# EAGLE design EEZ SMPS pre-regulator r1B1 (EAGLE 6.1)
Assembly variants: Farnell, TME

## Sheet 1 of 2
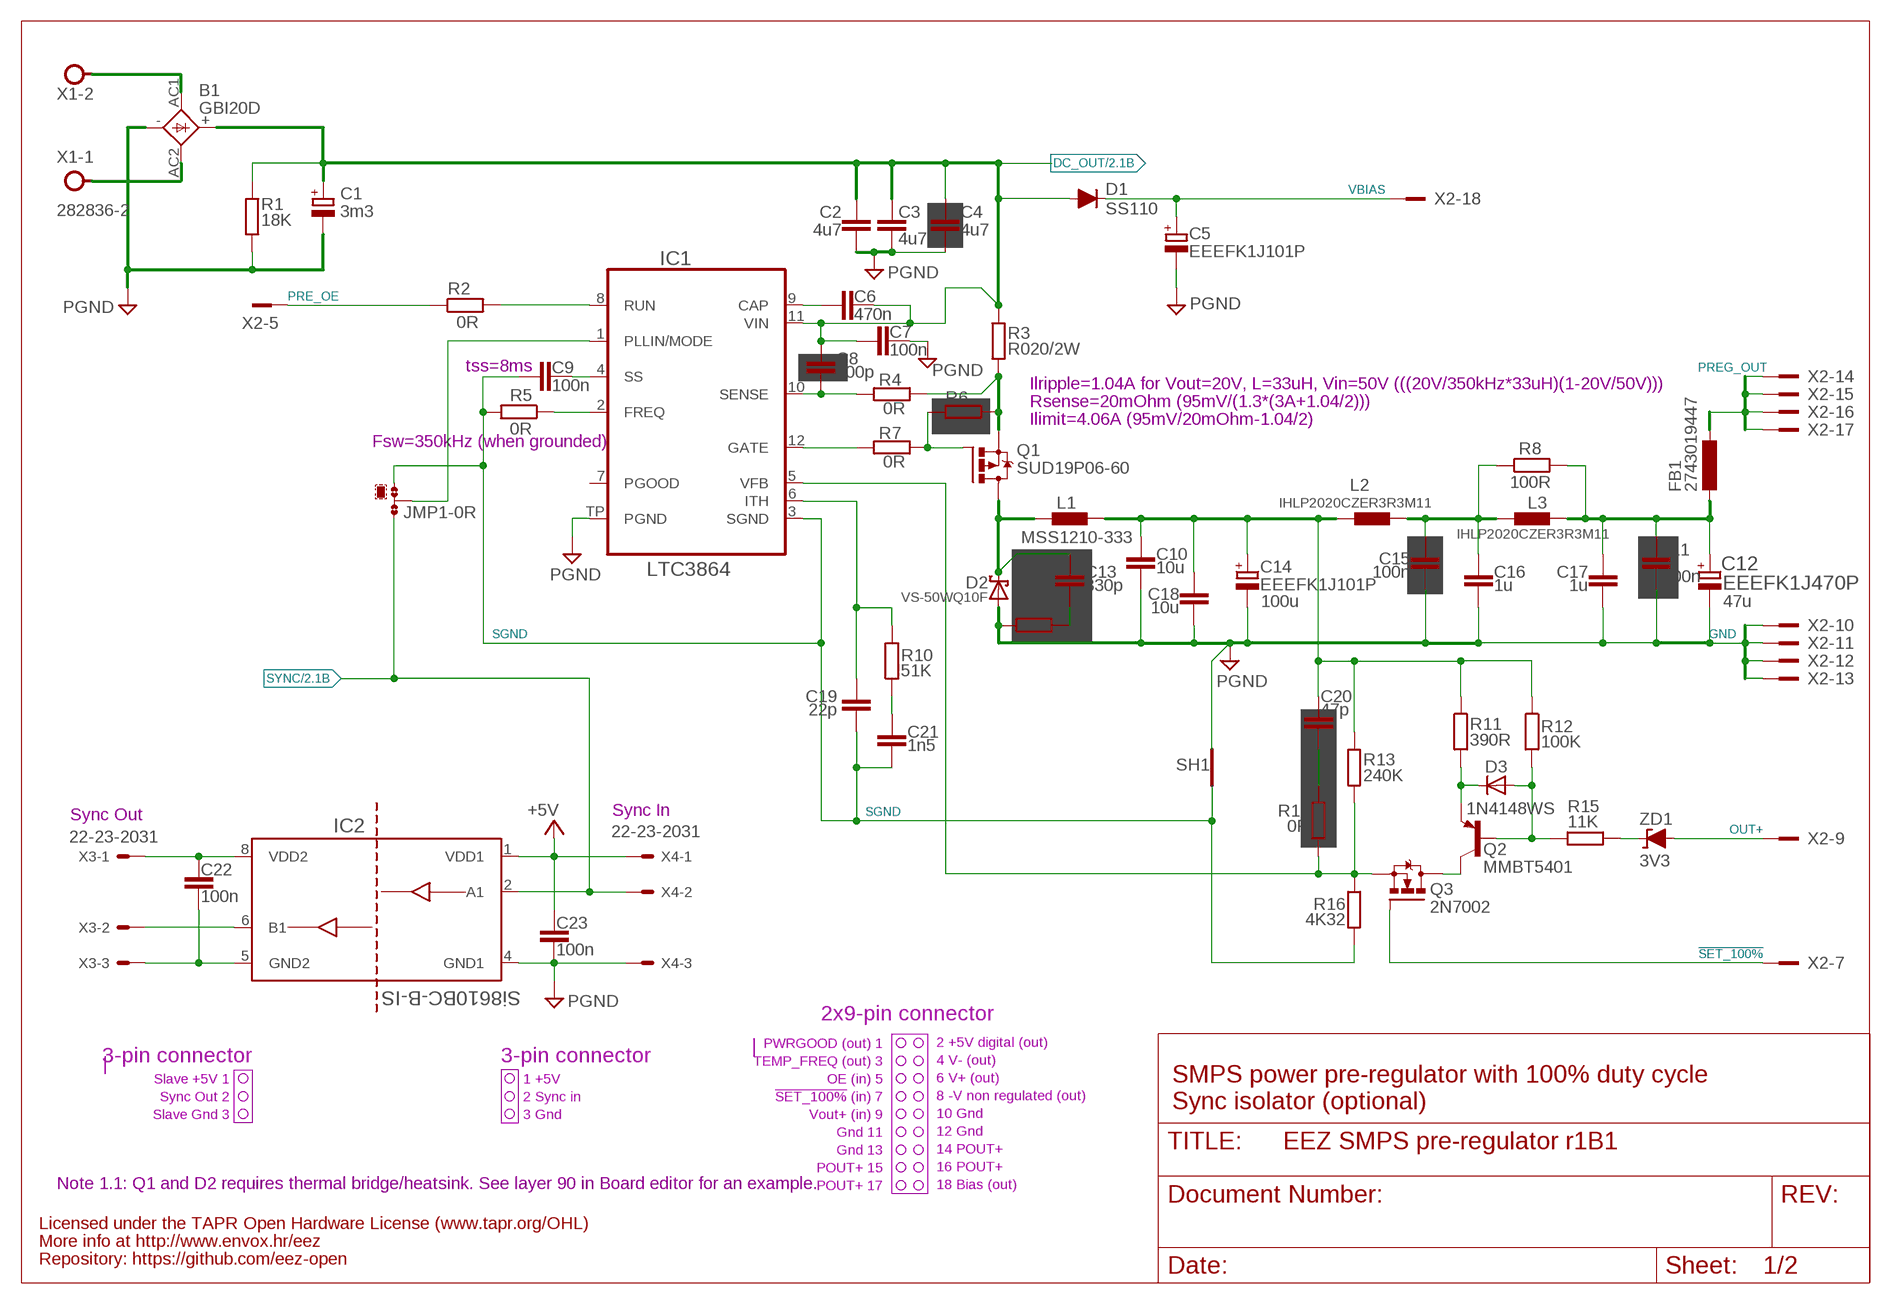
[diagram p0: schematic, sheet 1]

### Parts
B1  GBI20D  BRIDGEDIOTEC  [GBI20]
C1  3m3  ECAP10G_22.5MM  [ECAP10/22.5]
C2  4u7  C-EUC1210  [C1210]
C3  4u7  C-EUC1210  [C1210]
C4  4u7  C-EUC1210  [C1210]
C5  EEEFK1J101P  ECAP5G_10.5MM_F  [ECAP5/10.5+PANASONIC_F]
C6  470n  C-EUC0805  [C0805]
C7  100n  C-EUC0805  [C0805]
C8  100p  C-EUC0805  [C0805]
C9  100n  C-EUC0805  [C0805]
C10  10u  C-EUC1210  [C1210]
C11  100n  C-EUC0805  [C0805]
C12  EEEFK1J470P  EEE-FK1J470P-CASE-F  [CAPAE830X1050N]
C13  330p  C-EUC0805  [C0805]
C14  EEEFK1J101P  ECAP5G_10.5MM_F  [ECAP5/10.5+PANASONIC_F]
C15  100n  C-EUC0805  [C0805]
C16  1u  C-EUC1206  [C1206]
C17  1u  C-EUC1206  [C1206]
C18  10u  C-EUC1210  [C1210]
C19  22p  C-EUC0805  [C0805]
C20  47p  C-EUC0805  [C0805]
C21  1n5  C-EUC0805  [C0805]
C22  100n  C-EUC0603  [C0603]
C23  100n  C-EUC0603  [C0603]
D1  SS110  DIODEDO214AA  [DO214AA]
D2  VS-50WQ10F  SCHOTTKYTO252  [TO252@1]
D3  1N4148WS  DIODE-SOD323-W  [SOD323-W]
FB1  2743019447  L-EUL1812  [L1812]
IC1  LTC3864  [LTC_05-08-1666]
IC2  Si8610BC-B-IS  SI8610  [SOIC127P600X173-8N]
JMP1  0R-JUMPA  [A0R-JMP]
L1  MSS1210-333  COILCRAFT_MSS1210  [MSS1210]
L2  IHLP2020CZER3R3M11  IHLP-2020BZ-11  [IHLP-2020BZ-11]
L3  IHLP2020CZER3R3M11  IHLP-2020BZ-11  [IHLP-2020BZ-11]
Q1  SUD19P06-60  P-MOSFETDPAK  [TO229P990X239-3N]
Q2  MMBT5401  BC857B-PNP-SOT23-BEC  [SOT23-BEC]
Q3  2N7002  [SOT103P240X110-3N]
R1  18K  R-EU_R1206  [R1206]
R2  0R  R-EU_R0805  [R0805]
R3  R020/2W  R-EU_R2512  [R2512]
R4  0R  R-EU_R0805  [R0805]
R5  0R  R-EU_R0805  [R0805]
R6  100K  R-EU_R0805  [R0805]
R7  0R  R-EU_R0805  [R0805]
R8  100R  R-EU_R0805  [R0805]
R9  10R  R-EU_R1206  [R1206]
R10  51K  R-EU_R0805  [R0805]
R11  390R  R-EU_R0805  [R0805]
R12  100K  R-EU_R0805  [R0805]
R13  240K  R-EU_R0805  [R0805]
R14  0R  R-EU_R0805  [R0805]
R15  11K  R-EU_R0805  [R0805]
R16  4K32  R-EU_R0805  [R0805]
SH1  Sgnd to Pgnd short  SHORTNOHOLE  [SHORT_NOHOLE]
X1  282836-2  TBLOCK5.0_2A  [TBLOCK5.0_2]
X2  SSW-109-02-T-D-RA  [SSW-109-02-T-D-RA]
X3  22-23-2031  [22-23-2031]
X4  22-23-2031  [22-23-2031]
ZD1  3V3  ZENER-DIODEMINIMELF  [MINIMELF]

### Nets
!SET_100%: Q3.1(G) X2.7
+5V: C23.1 IC2.1(VDD1) X4.1 ; also sheet 2
DC_OUT: B1.+ C1.+ C2.1 C3.1 C4.1 C6.2 C7.1 C8.1 D1.A IC1.11(VIN) R1.1 R3.1 ; also sheet 2
FB: IC1.5(VFB) Q3.2(S) R13.2 R14.1 R16.1
GND [gnd]: B1.- C1.- C2.2 C3.2 C4.2 C5.- C5.-.1(-) C7.2 C10.2 C11.2 C12.2 C14.- C14.-.1(-) C15.1 C16.2 C17.2 C18.2 C23.2 D2.1(A) D2.2(A) IC1.TP(PGND) IC2.4(GND1) R1.2 R9.1 SH1.P$2(GND_B) X2.10 X2.11 X2.12 X2.13 X4.3 ; supply symbol labelled PGND ; also sheet 2
L_OUT: C10.1 C14.+ C14.+.1(+) C18.1 C20.1 L1.2 L2.1 R11.1 R12.1 R13.1
MODE: IC1.1(PLLIN/MODE) JMP1.2
N$4: D3.A Q2.B R12.2 R15.1
N$7: C20.2 R14.2
N$9: D3.C Q2.E R11.2
N$11: C21.1 R10.1
N$12: Q2.C Q3.3(D)
N$18: B1.AC1 X1.2
N$20: C19.1 IC1.6(ITH) R10.2
N$23: C6.1 IC1.9(CAP)
N$24: C8.2 IC1.10(SENSE) R4.2
N$25: R15.2 ZD1.C
N$28: IC1.12(GATE) R7.2
N$30: Q1.1(G) R6.1 R7.1
N$31: IC1.2(FREQ) R5.1
N$33: C9.2 IC1.4(SS)
N$34: B1.AC2 X1.1
N$35: C15.2 C16.1 L2.2 L3.1 R8.1
N$38: C13.2 R9.2
N$127: IC2.6(B1) X3.2
N$193: C22.1 IC2.8(VDD2) X3.1
N$198: C22.2 IC2.5(GND2) X3.3
OUT+: X2.9 ZD1.A
P_OUT: C11.1 C12.1 C17.1 FB1.1 L3.2 R8.2
PRE_OE: R2.1 X2.5
PREG_OUT: FB1.2 X2.14 X2.15 X2.16 X2.17
SD: IC1.8(RUN) R2.2
SENSE: Q1.3(S) R3.2 R4.1 R6.2
SGND: C9.1 C19.2 C21.2 IC1.3(SGND) JMP1.1 R5.2 R16.2 SH1.P$1(GND_A)
SW [sw]: C13.1 D2.3(C) L1.1 Q1.2(D)
SYNC: IC2.2(A1) JMP1.3 X4.2 ; also sheet 2
VBIAS: C5.+ C5.+.1(+) D1.C X2.18
Unconnected: IC1.7(PGOOD)

### Notes on the sheet
- tss=8ms
- Ilripple=1.04A for Vout=20V, L=33uH, Vin=50V (((20V/350kHz*33uH)(1-20V/50V)))
- Rsense=20mOhm (95mV/(1.3*(3A+1.04/2)))
- Ilimit=4.06A (95mV/20mOhm-1.04/2)
- Fsw=350kHz (when grounded)
- 100u | 47u
- Sync Out | Sync In
- 2x9-pin connector
- PWRGOOD (out) 1
- 3-pin connector | 3-pin connector | 2 +5V digital (out)
- TEMP_FREQ (out) 3
- 4 V- (out)
- Slave +5V 1 | 1 +5V | OE (in) 5
- 6 V+ (out) | SMPS power pre-regulator with 100% duty cycle
- Sync Out 2 | 2 Sync in | !SET_100%! (in) 7
- 8 -V non regulated (out)
- Slave Gnd 3 | 3 Gnd | Vout+ (in) 9 | Sync isolator (optional)
- 10 Gnd
- Gnd 11
- 12 Gnd
- Gnd 13
- 14 POUT+
- POUT+ 15
- 16 POUT+
- POUT+ 17
- Note 1.1: Q1 and D2 requires thermal bridge/heatsink. See layer 90 in Board editor for an example. | 18 Bias (out)
- Licensed under the TAPR Open Hardware License (www.tapr.org/OHL)
- More info at http://www.envox.hr/eez
- Repository: https://github.com/eez-open

## Sheet 2 of 2
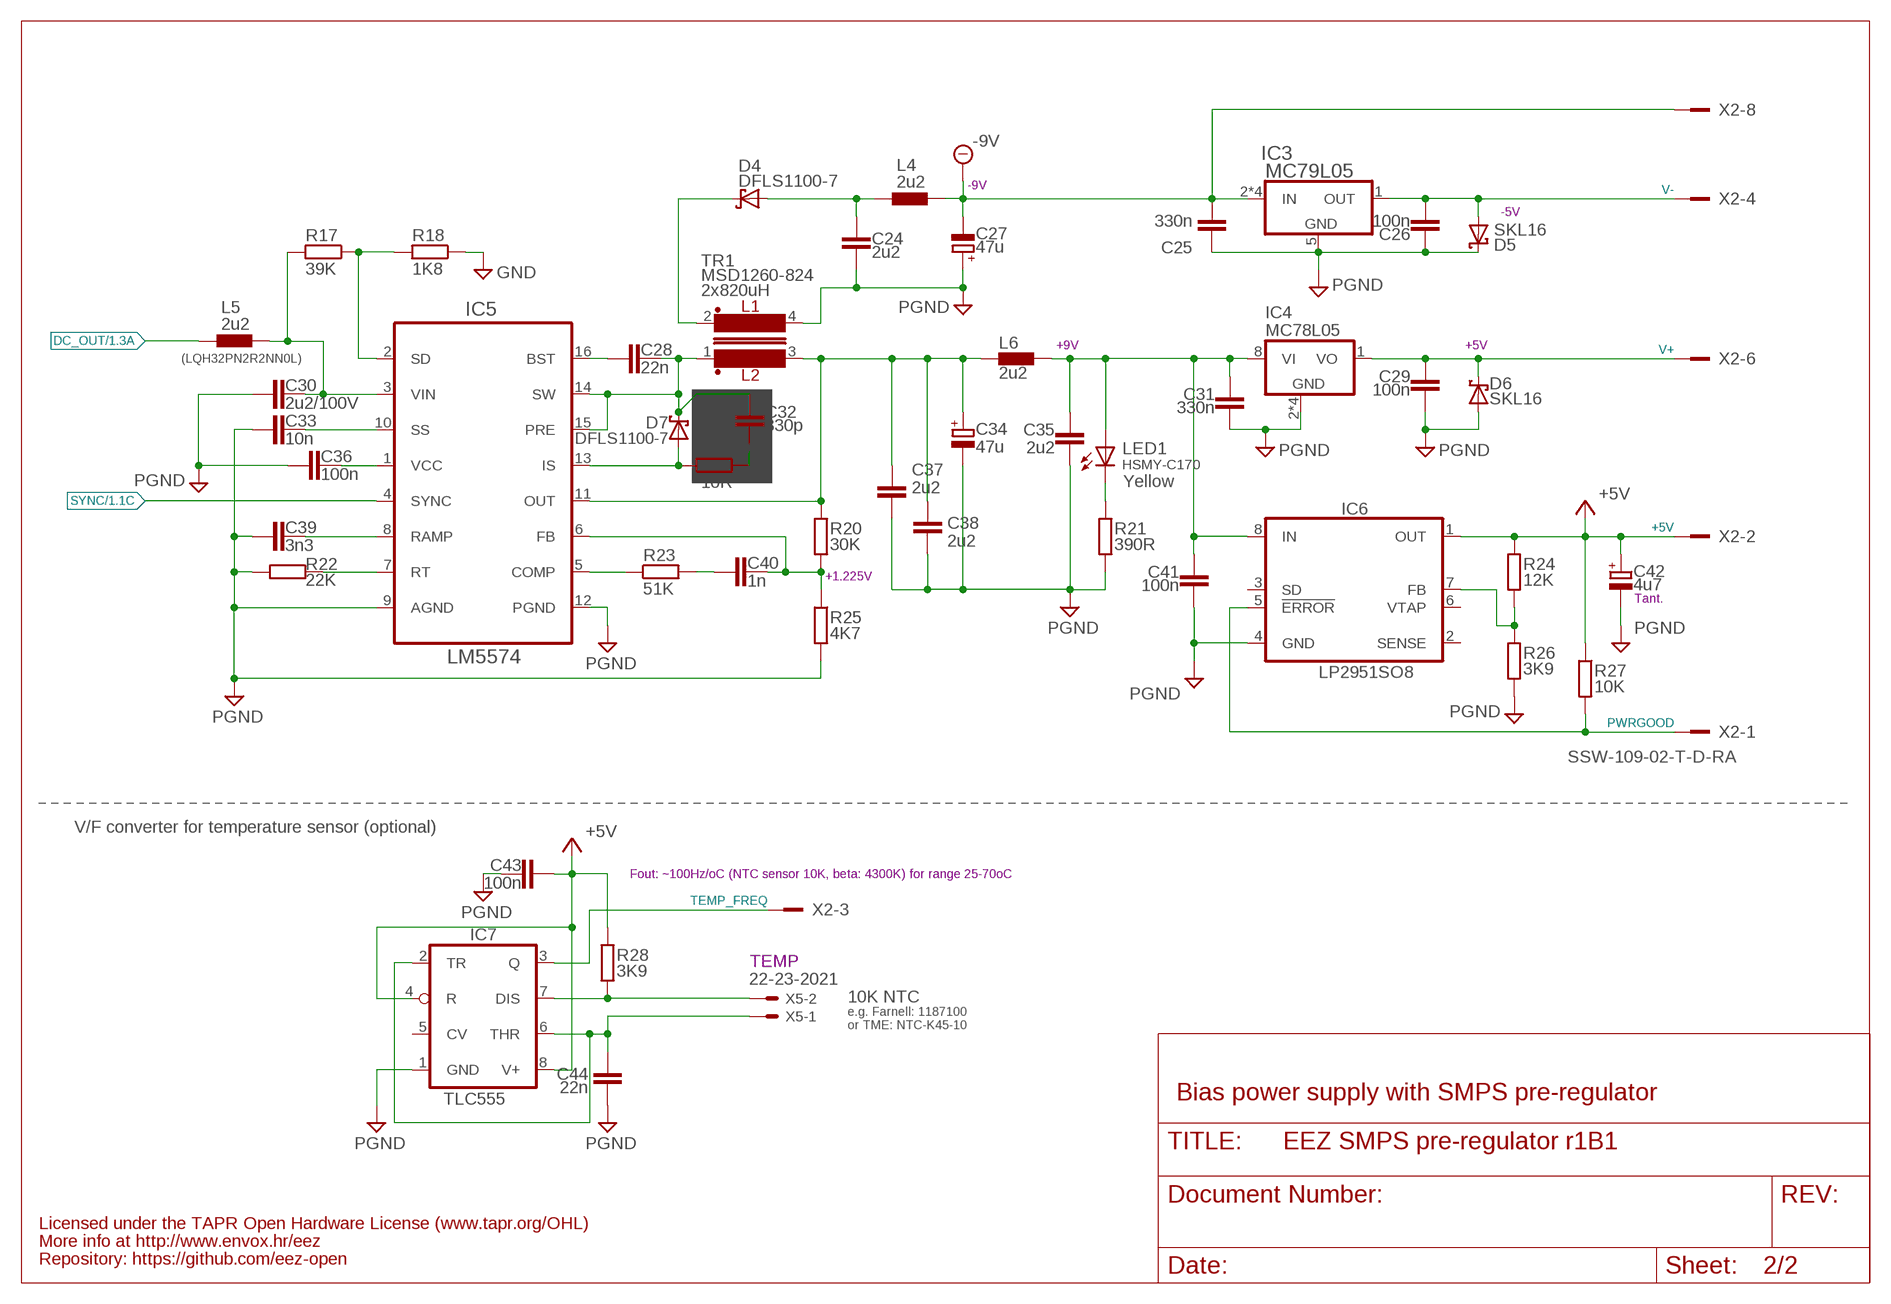
[diagram p1: schematic, sheet 2]

### Parts
C24  2u2  C-EUC0805  [C0805]
C25  330n  C-EUC0805  [C0805]
C26  100n  C-EUC0805  [C0805]
C27  47u  ECAPPANASONIC_H  [CAPAE660X610N]
C28  22n  C-EUC0805  [C0805]
C29  100n  C-EUC0805  [C0805]
C30  2u2/100V  C-EUC1210  [C1210]
C31  330n  C-EUC0805  [C0805]
C32  330p  C-EUC0805  [C0805]
C33  10n  C-EUC0805  [C0805]
C34  47u  ECAPPANASONIC_H  [CAPAE660X610N]
C35  2u2  C-EUC0805  [C0805]  (variant Farnell: 2320829)  (variant TME: CL21B225KAFNNNG )
C36  100n  C-EUC0805  [C0805]
C37  2u2  C-EUC0805  [C0805]  (variant Farnell: 2320829)  (variant TME: CL21B225KAFNNNG )
C38  2u2  C-EUC0805  [C0805]  (variant Farnell: 2320829)  (variant TME: CL21B225KAFNNNG )
C39  3n3  C-EUC0805  [C0805]
C40  1n  C-EUC0805  [C0805]
C41  100n  C-EUC0805  [C0805]
C42  4u7  ECAP1206  [EC1206]
C43  100n  C-EUC0603  [C0603]
C44  22n  C-EUC0805  [C0805]
D4  DFLS1100-7  SCHOTTKYSOD123  [SOD123]
D5  SKL16  SCHOTTKYSOD123  [SOD123]
D6  SKL16  SCHOTTKYSOD123  [SOD123]
D7  DFLS1100-7  SCHOTTKYSOD123  [SOD123]
IC3  MC79L05  MC79LXXSOIC  [SOIC127P600X173-8N]
IC4  MC78L05  MC78LXXSOIC8  [SOIC127P600X173-8N]
IC5  LM5574  [SOP65P640X110-16N]
IC6  LP2951SO8  [SOIC127P600X175-8N]
IC7  TLC555  LM555SOIC8  [SOIC127P600X175-8N]
L4  2u2  L1210  [L1210]
L5  2u2  L1210  [L1210]
L6  2u2  L1210  [L1210]
LED1  HSMY-C170  LEDCHIPLED_0805  [CHIPLED_0805]
R17  39K  R-EU_R0805  [R0805]
R18  1K8  R-EU_R0805  [R0805]
R19  10R  R-EU_R1206  [R1206]
R20  30K  R-EU_R0805  [R0805]
R21  390R  R-EU_R0805  [R0805]
R22  22K  R-EU_R0805  [R0805]
R23  51K  R-EU_R0805  [R0805]
R24  12K  R-EU_R0805  [R0805]
R25  4K7  R-EU_R0805  [R0805]
R26  3K9  R-EU_R0805  [R0805]
R27  10K  R-EU_R0805  [R0805]
R28  3K9  R-EU_R0805  [R0805]
TR1  MSD1260-824  COILCRAFT_MSD1260INV  [MSD1260]
X5  22-23-2021  [22-23-2021]

### Nets
+5V: C42.+ C43.1 IC6.1(OUT) IC7.4(R) IC7.8(V+) R24.1 R27.1 R28.2 X2.2 ; also sheet 1
+VNR1: C31.1 C35.1 C41.1 IC4.8(VI) IC6.8(IN) L6.2 LED1.A
-9V: C25.2 C27.2(-) IC3.2(IN) IC3.3(IN) IC3.6(IN) IC3.7(IN) L4.2 X2.8
DC_OUT: L5.1 ; also sheet 1
DC_PREG2: C30.1 IC5.3(VIN) L5.2 R17.2
GND [gnd]: C24.2 C25.1 C26.1 C27.1(+) C29.2 C30.2 C31.2 C33.2 C34.2(-) C35.2 C36.1 C37.2 C38.2 C39.1 C41.2 C42.- C43.2 C44.1 D5.C D6.A IC3.5(GND) IC4.2(GND) IC4.3(GND) IC4.6(GND) IC4.7(GND) IC5.9(AGND) IC5.12(PGND) IC6.4(GND) IC7.1(GND) R18.1 R21.2 R22.2 R25.2 R26.2 TR1.4 ; supply symbol labelled PGND ; also sheet 1
IS1: D7.A IC5.13(IS) R19.1
N$22: C24.1 D4.A L4.1
N$26: C40.2 R23.2
N$27: C40.1 IC5.6(FB) R20.2 R25.1
N$29: C28.2 IC5.16(BST)
N$32: IC5.5(COMP) R23.1
N$37: IC5.7(RT) R22.1
N$39: C36.2 IC5.1(VCC)
N$40: C39.2 IC5.8(RAMP)
N$41: C33.1 IC5.10(SS)
N$42: IC5.2(SD) R17.1 R18.2
N$43: LED1.C R21.1
N$46: C32.2 R19.2
N$47: IC6.7(FB) R24.2 R26.1
N$188: IC7.7(DIS) R28.1 X5.2
N$190: C44.2 IC7.2(TR) IC7.6(THR) X5.1
PWRGOOD: IC6.5(!ERROR) R27.2 X2.1
SW1: C28.1 C32.1 D7.C IC5.14(SW) IC5.15(PRE) TR1.1
SYNC: IC5.4(SYNC) ; also sheet 1
TEMP_FREQ: IC7.3(Q) X2.3
V+: C29.1 D6.C IC4.1(VO) X2.6
V-: C26.2 D5.A IC3.1(OUT) X2.4
VOUT+: C34.1(+) C37.1 C38.1 IC5.11(OUT) L6.1 R20.1 TR1.3
VOUT-: D4.C TR1.2
Unconnected: IC6.2(SENSE) IC6.3(SD) IC6.6(VTAP) IC7.5(CV)

### Notes on the sheet
- -9V
- -5V
- 2x820uH
- +9V | +5V
- (LQH32PN2R2NN0L)
- Yellow
- +1.225V
- Tant.
- V/F converter for temperature sensor (optional)
- Fout: ~100Hz/oC (NTC sensor 10K, beta: 4300K) for range 25-70oC
- TEMP
- 10K NTC
- e.g. Farnell: 1187100
- or TME: NTC-K45-10
- Bias power supply with SMPS pre-regulator
- Licensed under the TAPR Open Hardware License (www.tapr.org/OHL)
- More info at http://www.envox.hr/eez
- Repository: https://github.com/eez-open

## Library data of the parts
B1 = EEZ_Lib1:BRIDGE: MULTICOMP - KBP202G - BRIDGE RECTIFIER, 200V, 2A, KBP Farnell: 1861413
C1 C5 C14 C27 C34 C42 = EEZ_Lib1:ECAP
C2-C4 C6-C11 C13 C15-C26 C28-C33 C35-C41 C43 C44 = rcl:C-EU: CAPACITOR, European symbol
C12 = Panasonic-EEEFK_EEEFP:EEE-: Aluminum Electrolytic Capacitors,Surface Mount Type; MPN: EEE-FK1J470P; OC_FARNELL: 9696032; OC_NEWARK: 96K9403; PACKAGE: CASE-F; SUPPLIER: PANASONIC; TOLERANCE: ±20 %; VALUE: 47UF; VOLTAGERATING: 63 V
D1 = EEZ_Lib1:DIODE
D2 D4-D7 = EEZ_Lib1:SCHOTTKY
D3 = diode:DIODE-: DIODE
FB1 = rcl:L-EU: INDUCTOR, European symbol
IC1 = EEZ_Lib1:LTC3864: 60V Low Iq Step-Down DC/DC Controller with 100% Duty Cycle Capability
IC2 = EEZ_Lib1:SI8610: Low power 1-ch digital isolator Farnell: 2423233, 2423234
IC3 = EEZ_Lib1:MC79LXX: 3-terminal negative voltage regulator, up to 100mA
IC4 = EEZ_Lib1:MC78LXX: μA78L00 series positive voltage regulators
IC5 = EEZ_Lib1:LM5574: Step-Down Switching Regulator; MPN: LM5574MT; OC_FARNELL: 1325419; OC_NEWARK: 32M1267; PACKAGE: TSSOP-16; SUPPLIER: National Semiconductors
IC6 = EEZ_Lib1:LP2951: LP2950-N/LP2951-N Series of Adjustable Micropower Voltage Regulators
IC7 = EEZ_Lib1:LM555
JMP1 = jump-0r-smd:0R-JUMP: SMD 0R 0805 Jumper
L1 = EEZ_Lib1:COILCRAFT_MSS1210: Shielded Power Inductors, 12.3 × 12.3 mm footprint; 10 mm high
L2 L3 = EEZ_Lib1:IHLP-2020BZ-11: Low Profile, High Current IHLP® Inductors
L4-L6 = EEZ_Lib1:L1210
LED1 = led:LED: LED OSRAM: - CHIPLED LG R971, LG N971, LY N971, LG Q971, LY Q971, LO R971, LY R971 LH N974, LH R974 LS Q976, LO Q976, LY Q976 LO Q996 - Hyper CHIPLED LW Q18S LB Q993, LB Q99A, LB R99A - SideLED LS A670, LO A670, LY A670, LG A670, LP A670 LB A673, LV A673, LT A673, LW A673 LH A674 LY A675 LS A676, LA A676, LO A676, LY A676, LW A676 LS A679, LY A679, LG A679 - Hyper Micro SIDELED® LS Y876, LA Y876, LO Y876, LY Y876 LT Y87S - SmartLED LW L88C, LW L88S LB L89C, LB L89S, LG L890 LS L89K, LO L89K, LY L89K LS L896, LA L896, LO L896, LY L896 - TOPLED LS T670, LO T670, LY T670, LG T670, LP T670 LSG T670, LSP T670, LSY T670, LOP T670, LYG T670 LG T671, LOG T671, LSG T671 LB T673, LV T673, LT T673, LW T673 LH T674 LS T676, LA T676, LO T676, LY T676, LB T676, LH T676, LSB T676, LW T676 LB T67C, LV T67C, LT T67C, LS T67K, LO T67K, LY T67K, LW E67C LS E67B, LA E67B, LO E67B, LY E67B, LB E67C, LV E67C, LT E67C LW T67C LS T679, LY T679, LG T679 LS T770, LO T770, LY T770, LG T770, LP T770 LB T773, LV T773, LT T773, LW T773 LH T774 LS E675, LA E675, LY E675, LS T675 LS T776, LA T776, LO T776, LY T776, LB T776 LHGB T686 LT T68C, LB T68C - Hyper Mini TOPLED® LB M676 - Mini TOPLED Santana® LG M470 LS M47K, LO M47K, LY M47K Source: http://www.osram.convergy.de LUXEON: - LUMILED® LXK2-PW12-R00, LXK2-PW12-S00, LXK2-PW14-U00, LXK2-PW14-V00 LXK2-PM12-R00, LXK2-PM12-S00, LXK2-PM14-U00 LXK2-PE12-Q00, LXK2-PE12-R00, LXK2-PE12-S00, LXK2-PE14-T00, LXK2-PE14-U00 LXK2-PB12-K00, LXK2-PB12-L00, LXK2-PB12-M00, LXK2-PB14-N00, LXK2-PB14-P00, LXK2-PB14-Q00 LXK2-PR12-L00, LXK2-PR12-M00, LXK2-PR14-Q00, LXK2-PR14-R00 LXK2-PD12-Q00, LXK2-PD12-R00, LXK2-PD12-S00 LXK2-PH12-R00, LXK2-PH12-S00 LXK2-PL12-P00, LXK2-PL12-Q00, LXK2-PL12-R00 Source: www.luxeon.com KINGBRIGHT: KA-3528ASYC Source: www.kingbright.com
Q1 = EEZ_Lib1:P-MOSFET: HEXFET Power MosFet Source: http://www.irf.com/
Q2 = transistor:*-PNP-: PNP Transistror
Q3 = EEZ_Lib1:2N7002: N-CHANNEL ENHANCEMENT MODE FIELD EFFECT TRANSISTOR; MPN: 2N7002-7-F; OC_FARNELL: 1713823; OC_NEWARK: 25R5679; PACKAGE: SOT-23-3; SUPPLIER: DIODES INC.
R1-R28 = rcl:R-EU_: RESISTOR, European symbol
SH1 = EEZ_Lib1:SHORT
TR1 = EEZ_Lib1:COILCRAFT_MSD1260INV: Coilcraft Coupled Inductors MSD1260 (inverted pinouts)
X1 = EEZ_Lib1:TBLOCK5.0_2A
X2 = EEZ_Lib1:SSW-109-02-T-D-RA: Samtec SSW-109-02-T-D-RA Receptacle, 2.54MM, RA, 18-way; FARNELL: 1804359
X3 X4 = con-molex:22-23-2031: .100" (2.54mm) Center Header - 3 Pin; MF: MOLEX; MPN: 22-23-2031; OC_FARNELL: 1462950; OC_NEWARK: 30C0862
X5 = con-molex:22-23-2021: .100" (2.54mm) Center Header - 2 Pin; MF: MOLEX; MPN: 22-23-2021; OC_FARNELL: 1462926; OC_NEWARK: 25C3832
ZD1 = EEZ_Lib1:ZENER-DIODE

## Net classes
0 default: width 0.254 mm, drill 0.584 mm, clearance 0.254 mm
1 sw: width 0.254 mm, drill 0.584 mm, clearance 0.254 mm
2 gnd: width 0.254 mm, drill 0.584 mm, clearance 0.254 mm

## Board
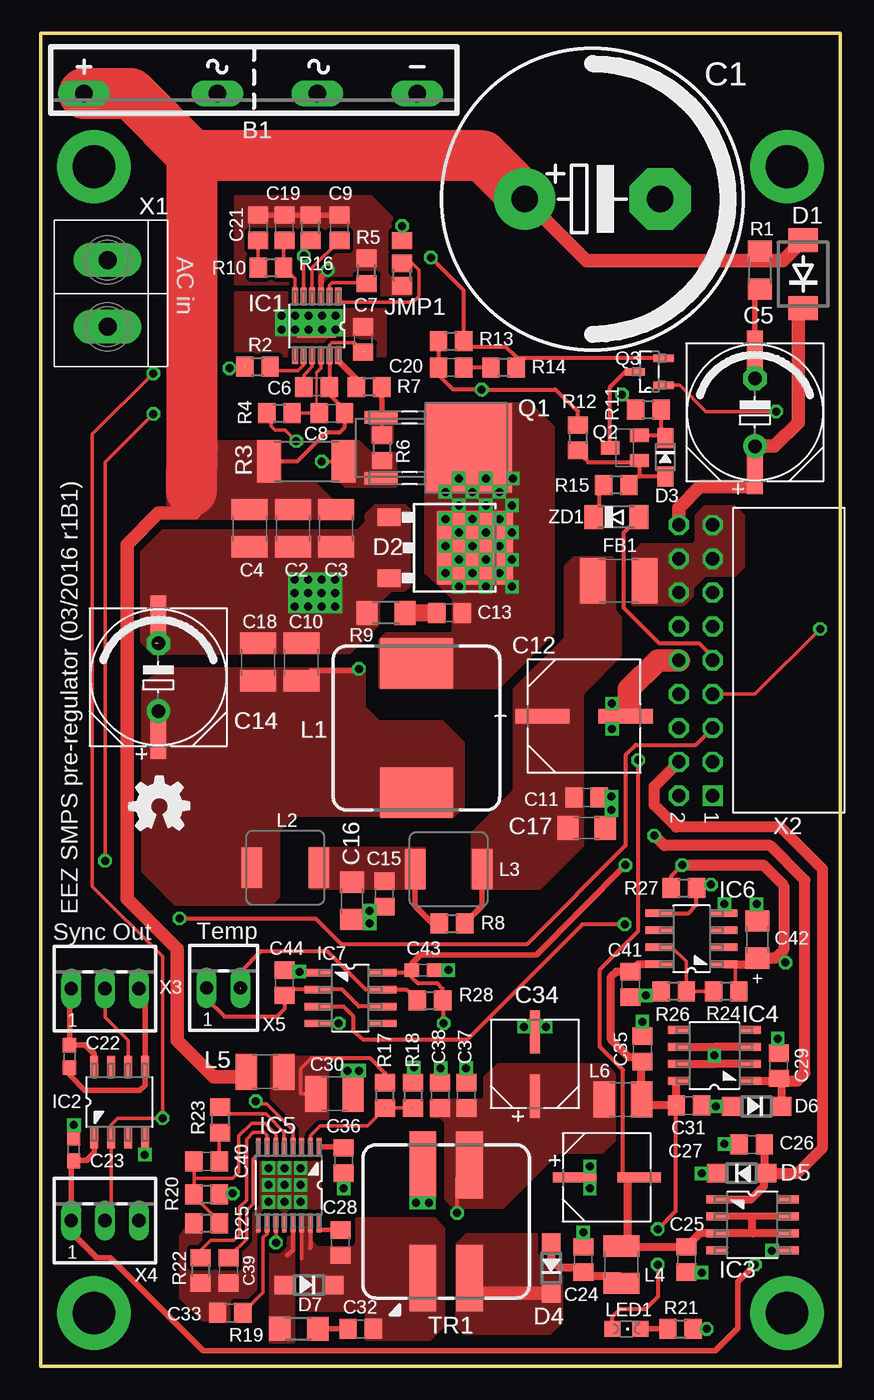
[diagram p2: board, top side]
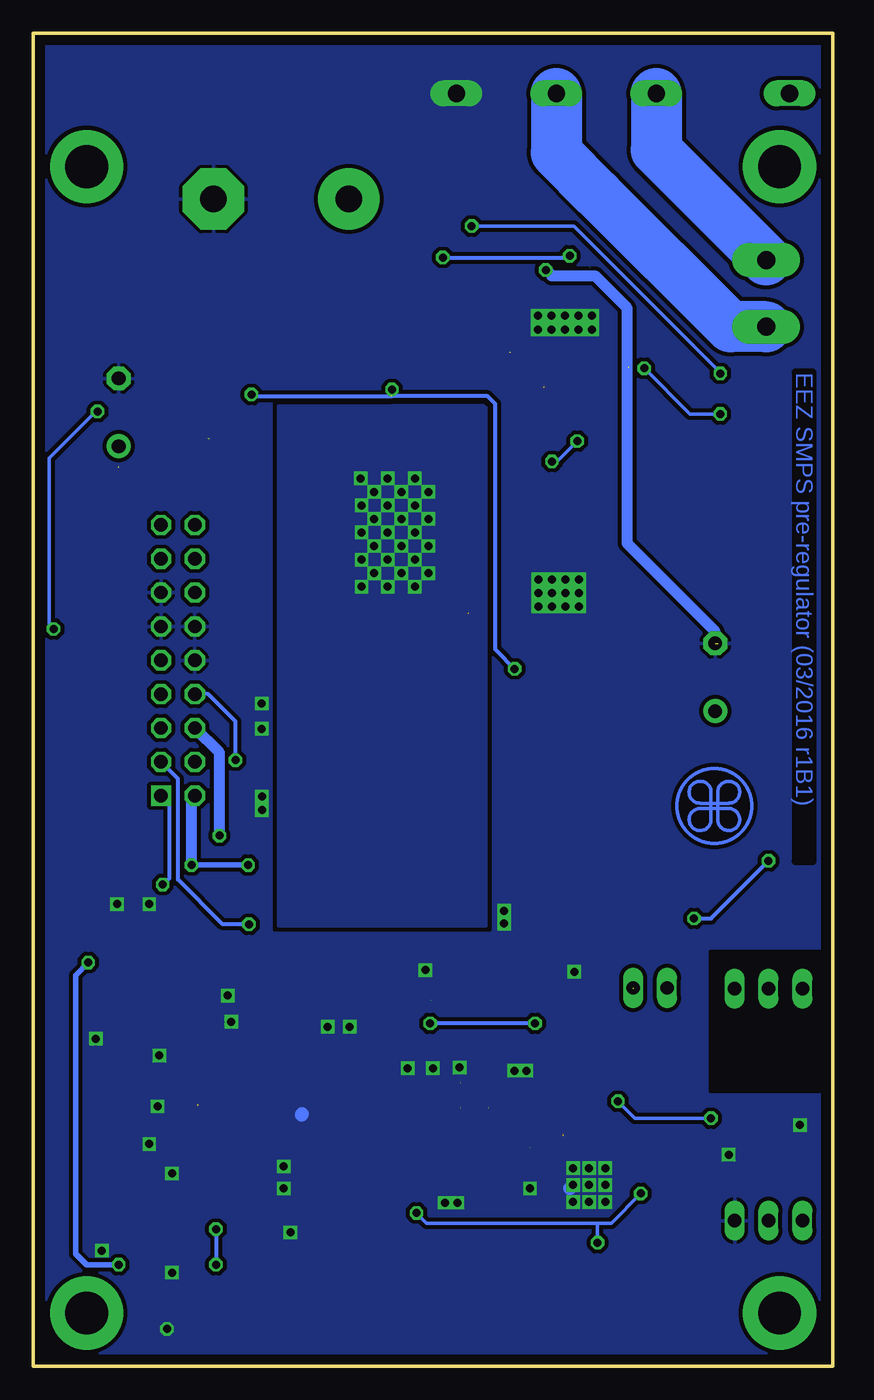
[diagram p3: board, bottom side, seen from below]

Size 60 x 100 mm. Coordinates in mm from the lower left corner, seen from the top.
Outline: 0,100 60,100 60,0 0,0 0,100
Copper layers (1+5*16): Top 0.035mm / dielectric 0.75mm / Route5 0.035mm / dielectric 0.75mm / Bottom 0.035mm
Design rules: minimum track width 10mil, minimum drill 0.5mm, track to track 8mil, track to pad 8mil, pad to pad 8mil, via to via 8mil, smd to smd 8mil, copper to edge 30mil, drill to drill 8mil, minimum pad ring 10mil, minimum via ring 8mil, stop-mask expansion 0mil, vias tented up to drill 25mil, thermal gap 10mil

### Footprints (pad centres in the part's own frame; a part is rotated, then mirrored left to right if it is on the bottom)
GBI20 = drill 1.3 long: + -12.75,-3.5; - 12.25,-3.5; AC1 -2.75,-3.5; AC2 4.75,-3.5
ECAP10/22.5 = drill 2.007 pad 4.597: + -5.08,0 | drill 2.007 pad 4.597 octagon: - 5.08,0
C1210 = smd 1.6 x 2.7: 1 -1.4,0; 2 1.4,0
ECAP5/10.5+PANASONIC_F = drill 1.016 pad 1.778: + -2.54,0 | smd 4.166 x 1.194: +.1 -4.064,0; -.1 4.064,0 | drill 1.016 pad 1.778 octagon: - 2.54,0
C0805 = smd 1.3 x 1.5: 1 -0.95,0; 2 0.95,0
CAPAE830X1050N = smd 4.064 x 1.092: 1 -3.124,0; 2 3.124,0
C1206 = smd 1.6 x 1.8: 1 -1.4,0; 2 1.4,0
C0603 = smd 1.1 x 1: 1 -0.85,0; 2 0.85,0
CAPAE660X610N = smd 3.251 x 0.762: 1 -2.413,0; 2 2.413,0
EC1206 = smd 1.6 x 1.8: + -1.4,0; - 1.4,0
DO214AA = smd 1.8 x 2.2: A 2.55,0; C -2.55,0
TO252@1 = smd 1.3 x 1.7: 1 -2.285,-5.49; 2 2.285,-5.49 | smd 5.5 x 5.7: 3 0,0.95
SOD323-W = smd 1.5 x 1.2: A 1.45,0; C -1.45,0
SOD123 = smd 1.4 x 1.4: A 1.9,0; C -1.9,0
L1812 = smd 1.9 x 3.4: 1 -1.95,0; 2 1.95,0
LTC_05-08-1666 = smd 1.27 x 0.457: 1 -2.235,1.63; 2 -2.235,0.98; 3 -2.235,0.33; 4 -2.235,-0.33; 5 -2.235,-0.98; 6 -2.235,-1.63; 7 2.235,-1.63; 8 2.235,-0.98; 9 2.235,-0.33; 10 2.235,0.33; 11 2.235,0.98; 12 2.235,1.63 | smd 1.753 x 2.946: TP 0,0
SOIC127P600X173-8N = smd 1.55 x 0.6: 1 -2.7,1.9; 2 -2.7,0.63; 3 -2.7,-0.64; 4 -2.7,-1.91; 5 2.7,-1.91; 6 2.7,-0.64; 7 2.7,0.63; 8 2.7,1.9
SOP65P640X110-16N = smd 1.422 x 0.356: 1 -2.845,2.286; 2 -2.845,1.626; 3 -2.845,0.965; 4 -2.845,0.33; 5 -2.845,-0.33; 6 -2.845,-0.965; 7 -2.845,-1.626; 8 -2.845,-2.286; 9 2.845,-2.286; 10 2.845,-1.626; 11 2.845,-0.965; 12 2.845,-0.33; 13 2.845,0.33; 14 2.845,0.965; 15 2.845,1.626; 16 2.845,2.286
SOIC127P600X175-8N = smd 1.981 x 0.559: 1 -2.464,1.905; 2 -2.464,0.635; 3 -2.464,-0.635; 4 -2.464,-1.905; 5 2.464,-1.905; 6 2.464,-0.635; 7 2.464,0.635; 8 2.464,1.905
A0R-JMP = smd 1.5 x 1.3: 1 0,1.7; 2 0,0; 3 0,-1.7
MSS1210 = smd 5.5 x 3.8: 1 0,4.85; 2 0,-4.85
IHLP-2020BZ-11 = smd 3.048 x 1.524: 1 0,2.515; 2 0,-2.515
L1210 = smd 1.6 x 2.7: 1 -1.4,0; 2 1.4,0
CHIPLED_0805 = smd 1.2 x 1.2: A 0,-1.05; C 0,1.05
TO229P990X239-3N = smd 0.94 x 2.489: 1 -2.286,-6.401; 3 2.286,-6.401 | smd 6.731 x 6.528: 2 0,0.152
SOT23-BEC = smd 1 x 1.4: B -0.95,-1.1; C 0,1.1; E 0.95,-1.1
SOT103P240X110-3N = smd 1.524 x 0.559: 1 -1.079,1.016; 2 -1.079,-1.016; 3 1.079,0
R1206 = smd 1.6 x 1.803: 1 -1.422,0; 2 1.422,0
R0805 = smd 1.3 x 1.5: 1 -0.95,0; 2 0.95,0
R2512 = smd 1.8 x 3.2: 1 -2.8,0; 2 2.8,0
SHORT_NOHOLE = smd 0.5 x 0.25 bottom: P$1 0,0.117; P$2 0,-0.117
MSD1260 = smd 2 x 5: 1 1.75,4.25; 2 -1.75,4.25; 3 -1.75,-4.25; 4 1.75,-4.25
TBLOCK5.0_2 = drill 1.35 pad 2.54 long: 1 0,0; 2 0,-5
SSW-109-02-T-D-RA = drill 1 pad 1.5 square: 1 20.32,2.54 | drill 1 pad 1.5 octagon: 2 20.32,0; 3 17.78,2.54; 4 17.78,0; 5 15.24,2.54; 6 15.24,0; 7 12.7,2.54; 8 12.7,0; 9 10.16,2.54; 10 10.16,0; 11 7.62,2.54; 12 7.62,0; 13 5.08,2.54; 14 5.08,0; 15 2.54,2.54; 16 2.54,0; 17 0,2.54; 18 0,0
22-23-2031 = drill 1 long: 1 -2.54,0; 2 0,0; 3 2.54,0
22-23-2021 = drill 1 long: 1 -1.27,0; 2 1.27,0
MINIMELF = smd 1.4 x 1.8: A 1.7,0; C -1.7,0

### Placement (x,y rotation side)
B1  16,99 0 top
C1  41.4,87.57 0 top
C2  18.92,62.87 270 top
C3  22.16,62.87 270 top
C4  15.68,62.87 270 top
C5  53.59,71.56 90 top
C6  20.7,73.47 0 top
C7  24.19,77.03 90 top
C8  21.84,71.5 180 top
C9  22.42,85.41 270 top
C10  19.56,52.83 90 top
C11  40.96,42.67 0 top
C12  40.77,48.77 0 top
C13  30.67,56.52 180 top
C14  8.83,51.69 90 top
C15  25.78,35.43 90 top
C16  23.37,34.92 270 top
C17  40.96,40.39 0 top
C18  16.32,52.83 90 top
C19  18.29,85.41 90 top
C20  30.8,74.93 0 top
C21  16.32,85.41 90 top
C22  2.16,23.24 270 top
C23  2.48,16.26 90 top
C24  40.7,8 90 top
C25  48.45,8 90 top
C26  53.34,16.64 0 top
C27  42.48,14.16 0 top
C28  22.48,9.27 90 top
C29  55.37,22.54 90 top
C30  22.03,20.45 0 top
C31  48.64,19.56 0 top
C32  24,2.79 180 top
C33  14.22,4 180 top
C34  37.08,22.67 90 top
C35  45.15,23.81 90 top
C36  22.73,15.43 90 top
C37  31.94,20.32 90 top
C38  29.97,20.32 90 top
C39  14.1,7.18 90 top
C40  12.45,15.37 0 top
C41  44.26,28.64 270 top
C42  53.78,32 90 top
C43  28.7,29.72 0 top
C44  18.29,28.77 270 top
D1  57.21,81.92 90 top
D2  31.62,61.4 270 top
D3  46.86,68.2 270 top
D4  38.29,7.37 90 top
D5  52.58,14.48 0 top
D6  53.72,19.49 180 top
D7  20.13,6.1 180 top
EEZ_SIGNATURE  SIGNATURESMALL  [SIGNATURE_5MM]  8.89,42.04 180 top
FB1  43.37,58.93 0 top
IC1  20.7,78.04 270 top
IC2  5.91,19.81 90 top
IC3  53.4,10.6 0 top
IC4  50.55,23.3 180 top
IC5  18.61,13.59 270 top
IC6  48.83,32.07 180 top
IC7  23.24,27.62 0 top
JMP1  27.11,82.74 180 top
L1  28.19,47.88 0 top
L2  18.35,37.4 90 top
L3  30.61,37.27 90 top
L4  43.56,7.62 90 top
L5  16.83,22.1 0 top
L6  43.69,20 0 top
LED1  43.94,2.79 270 top
Q1  31.94,68.9 270 top
Q2  43.81,68.9 90 top
Q3  45.66,74.61 180 top
R1  53.98,82.23 270 top
R2  16.26,74.99 0 top
R3  19.94,67.88 0 top
R4  17.91,71.5 0 top
R5  24.45,82.17 90 top
R6  25.59,68.9 270 top
R7  24.64,73.47 180 top
R8  30.86,33.21 0 top
R9  25.91,56.52 0 top
R10  17.27,82.42 0 top
R11  45.59,71.75 0 top
R12  40.32,69.66 270 top
R13  30.8,76.9 0 top
R14  34.73,74.93 180 top
R15  43.18,66.1 180 top
R16  20.26,85.41 90 top
R17  25.84,20.32 90 top
R18  27.94,20.32 270 top
R19  19.37,2.79 0 top
R20  12.45,12.89 180 top
R21  48.01,2.79 0 top
R22  12,7.18 270 top
R23  13.46,18.48 270 top
R24  51.44,28.13 180 top
R25  12.45,10.73 180 top
R26  47.5,28.13 180 top
R27  48.26,35.88 0 top
R28  29.21,27.43 0 top
SH1  8.7,54.23 270 top
TR1  30.42,10.86 180 top
X1  5,77.99 180 top
X2  47.88,63.12 270 top
X3  4.83,28.32 0 top
X4  4.83,10.92 0 top
X5  13.72,28.38 0 top
ZD1  43.18,63.69 0 top

### Tracks (layer width: path | path; a pad name or v marks a point on that pad's centre or on a via)
!SET_100%  (via drill 0.6)
  Top 0.254: X2.7 53.59,50.42 v58.48,55.31 | v55.18,71.63 49.91,71.63 47.94,73.6 Q3.1
  Bottom 0.254: v58.48,55.31 58.8,55.63 58.8,68.14 55.31,71.63 v55.18,71.63
+5V  (via drill 0.6)  (1 unrouted)
  Top 0.254: R24.1 52.13,28.19 52.13,30.1 52.07,30.16
  Top 0.305: 28.19,29.38 C43.1 | IC7.8 27.66,29.53 C43.1 | R28.2 30.16,28.32 29.78,28.7 28.32,28.7 27.88,29.15 27.88,29.65 27.88,29.69 C43.1 | IC7.4 v22.35,25.72 | v30.23,25.72 30.23,27.37 R28.2 | R27.1 47.31,36.77 v48.13,37.59
  Top 0.406: IC2.1 4,16.01 3.43,15.43 2.5,15.43 C23.1 2.29,15.22 X4.1 2.29,10.03 4.19,8.13 5.21,8.13 12.19,1.14 50.61,1.14 52.32,2.86 52.32,6.35 v53.59,7.62 | v55.88,30.29 55.82,30.29 55.31,30.8 | v43.88,37.59 37.21,30.86 28.51,30.86 27.88,30.23 27.88,29.65
  Top 0.61: IC6.1 52.07,30.16 53.34,30.16 C42.+
  Top 0.813: v48.13,37.59 54.23,37.59 55.75,36.07 55.75,31.24 55.31,30.8 55.12,30.61 C42.+
  Bottom 0.305: v22.35,25.72 v30.23,25.72
  Bottom 0.406: v53.59,7.62 56.01,7.62 56.83,8.45 56.83,29.34 v55.88,30.29 | v48.13,37.59 v43.88,37.59
  Bottom 0.813: v48.13,37.59 48.13,42.55 X2.2
+VNR1  (via drill 0.6)  (1 unrouted)
  Top 0.305: 47.62,19.56 47.62,11.62 v46.29,10.29 | v46.29,7.62 46.29,5.21 45.4,4.32 43.5,4.32 42.89,3.71 LED1.A
  Top 0.61: C31.1 47.69,21.25 IC4.8 | 47.69,19.49 47.62,19.56 45.53,19.56 L6.2 45.09,22.8 C35.1 45.15,23.18 44.13,23.18 42.8,24.51 42.8,29.21 43.18,29.59 C41.1 44.83,30.16 IC6.8
  Bottom 0.305: v46.29,10.29 v46.29,7.62 46.29,7.56
-9V  (via drill 0.6)
  Top 0.254: 53.03,11.23 53.34,11.23 53.4,11.18
  Top 0.305: v44.83,45.47 44.83,32.64 41.97,29.78 41.97,23.94 43.69,22.23 43.69,14.16 43.75,14.1 44.07,14.1
  Top 0.406: IC3.2 | 53.03,11.23 53.02,11.24
  Top 0.508: 53.02,11.24 IC3.2 | IC3.7 53.03,11.23
  Top 0.61: L4.2 44,9.02 44.07,8.95 | 44.07,8.95 44.07,14.1 44.13,14.16 C27.2 | 53.4,9.97 53.4,9.96 IC3.3 49.46,9.96 C25.2 44.07,8.95 | 53.4,9.97 53.4,11.18 | IC3.6 53.41,9.96 53.4,9.97
  Bottom 0.305: v44.83,45.47 44.83,48.39 46.86,50.42 X2.8
DC_OUT  (2 unrouted)
  Top 0.254: 13.02,21.84 13.24,22.07 | C6.2 21.68,73.5 21.68,73.44 | 24.26,76.07 23.56,76.8 21.84,76.8 21.68,76.61 IC1.11 | 11.25,69.02 11.37,68.96
  Top 0.305: 15.49,21.72 15.49,22.03 L5.1 | IC1.11 21.68,73.5 | R3.1 19.24,67.88 21.4,70.04 22.42,70.04 22.79,70.42 C8.1 22.79,71.76 21.65,72.9 21.65,73.41 | C6.2 21.72,73.47
  Top 0.406: 12.95,21.72 13.02,21.72 13.02,21.84 | R1.1 54.23,83 54.29,82.93
  Top 1.016: 11.49,64.01 8.83,64.01 6.48,61.66 6.48,35.05 10.22,31.3 10.22,24.45 12.95,21.72 15.49,21.72 | C1.+ 40.96,82.93 54.29,82.93 55.68,82.93 D1.A
  Top 3.81: C1.+ 36.32,87.63 33.15,90.81 12,90.81 | 12,90.81 11.43,90.81 11.37,90.87 | 11.37,90.87 6.74,95.5 B1.+ | 11.3,65.66 11.37,68.96 11.37,90.87 | 11.37,90.87 12,90.81
  pour Top (isolate 0.305, no thermals): 21.91,63.63 9.53,63.63 9.53,69.34 17.78,69.34 17.78,66.48 18.1,66.17 20.64,66.17 21.91,64.9
DC_PREG2
  Top 0.254: 20.32,23.11 19.49,22.29 19.49,20.45 C30.1
  Top 0.305: 20.32,23.11 24.7,23.11 25.84,21.97 R17.2
  pour Top (isolate 0.305, no thermals): 21.53,16.64 17.34,16.64 17.34,23.18 21.53,23.18
FB  (via drill 0.6)
  Top 0.254: 20,84.46 R16.1 19.72,83.92 19.72,83.34 v19.75,83.31 19.72,83.28 IC1.5
  Top 0.305: v29.27,83.19 31.75,80.71 R13.2 32.19,76.45 34.92,76.45 35.68,75.69 R14.1 35.81,75.06 35.81,75.63 Q3.2
  Bottom 0.305: v29.27,83.19 19.88,83.19 v19.75,83.31
GND  (via drill 0.6)  (2 unrouted)
  Top 0.254: C7.2 24.57,78.52 | TR1.4 28.67,12.71 v29.12,12.26
  Top 0.305: C36.1 v22.73,13.34 | C25.1 v49.59,7.01 | v23.01,22.16 23.01,20.87 C30.2 | v24.68,33.21 23.68,33.21 C16.2 | v24.68,34.16 25.46,34.16 C15.1 | IC2.4 v7.82,15.88 v7.81,15.88 | C41.2 45.28,27.69 v45.4,27.81 45.72,28.13 R26.2 | D5.C 49.62,14.48 v49.59,14.45 | C26.1 51.35,16.64 v51.31,16.68 | C42.- 53.78,34.61 v53.72,34.67 | IC6.4 51.3,34.66 v51.31,34.67 | C43.2 v30.58,29.72 | IC7.1 19.47,29.53 v19.41,29.59 19.28,29.71 C44.1 | C35.2 v45.15,25.84
  Top 0.406: v40.7,10.03 C24.2 | v49.97,2.79 R21.2 | C27.1 41.02,14.16 v41.21,14.99 | v55.31,24.57 55.31,23.56 C29.2 | C38.2 29.97,22.31 v30.01,22.35 | C37.2 31.94,22.33 v31.91,22.35 | R18.1 27.94,22.42 v28,22.42 | C5.- C5.-.1 53.59,80.17 R1.2 | v37.91,25.46 37.27,25.46 C34.2 | C16.2 23.37,33.43 | C11.2 v42.84,42.74 | C17.2 v42.84,41.72 | v54.86,8.66 56.1,8.66 IC3.5 | C23.2 v2.48,18.1 | 44.13,49.21 43.89,49.21 C12.2
  Top 0.61: D6.A v50.67,19.49 50.61,19.56 C31.2 | IC4.2 50.54,22.67 50.48,22.73 | IC4.7 50.42,22.67 50.48,22.73 | 50.48,22.73 50.55,22.8 v50.55,23.3 50.55,23.94 | IC4.6 50.54,23.95 50.55,23.94 | IC4.3 50.55,23.95 50.55,23.94
  Top 1.676: X2.10 46.29,52.96 44.13,50.8 44.13,49.21
  Bottom 1.016: 19.75,13.34 v19.49,13.59 | 39.88,18.86 39.81,18.92
  other vias: 21.08,58.01 19.05,58.01 21.08,57 21.08,59.03 20.07,59.03 20.07,58.01 19.05,57 20.07,57 22.1,58.01 22.1,59.03 22.1,57 19.05,59.03 20.1,78.8 19.09,78.8 21.12,78.8 22.14,78.8 21.12,77.79 20.1,77.79 19.09,77.79 18.07,77.79 22.14,77.79 18.07,78.8 28.17,12.26 18.29,12.32 18.29,13.59 18.29,14.86 17.08,13.59 19.49,14.86 19.49,12.32 17.08,14.86 17.08,12.32 23.9,22.16 36.26,25.46 41.21,13.34 42.86,47.82 42.86,49.72
  pour Bottom (isolate 0.305, rank 3): 0,0 60.01,0 60.01,100.01 0,100.01
  pour Top (isolate 0.305, rank 3, no thermals): 14.61,80.52 25.84,80.52 25.84,75.82 14.61,75.82
  pour Top (isolate 0.305, no thermals): 20.95,15.88 20.95,11.24 16.64,11.24 16.64,3.43 12.13,3.49 10.48,5.14 10.48,9.78 10.92,10.35 12,10.35 12,9.46 14.29,9.46 14.29,15.88
  pour Top (isolate 0.305, no thermals): 27.62,64.26 27.62,58.55 27.3,58.23 26.29,58.23 25.34,57.28 25.34,55.69 23.18,53.53 8.45,53.47 7.56,54.36 7.56,61.09 9.14,62.67 23.81,62.67 24.45,63.31 24.45,63.94 25.08,64.58 27.3,64.58
HOLE_DL  (via drill 3.2 pad 5.5)
  other vias: 4,4
HOLE_DR  (via drill 3.2 pad 5.5)
  other vias: 56,4
HOLE_UL  (via drill 3.2 pad 5.5)
  other vias: 4,90
HOLE_UR  (via drill 3.2 pad 5.5)
  other vias: 56,90
IS1
  Top 0.356: IC5.13 18.94,8.71 18.48,8.32
  pour Top (isolate 0.305, rank 2, no thermals): 18.99,9.65 18.99,1.84 17.21,1.84 17.27,9.65
L_OUT  (via drill 0.6)  (1 unrouted)
  Top 0.305: R13.1 C20.1 29.84,74.36 30.92,73.28 v33.08,73.28 38.61,73.28 40.32,71.63 R12.1 | R11.1 44.45,72.07 v43.62,72.9
  Top 0.406: v23.88,52.32 23.75,52.2 20.32,52.2 C10.1
  Bottom 0.305: v33.08,73.28 33.08,72.83 33.15,72.77 43.5,72.77 v43.62,72.9 | v23.88,52.32 25.34,53.78 25.34,72.2 25.91,72.77 33.08,72.77
  pour Top (isolate 0.406, no thermals): 9.02,52.32 24.07,52.32 24.26,52.13 24.26,49.47 25.4,48.32 30.16,48.32 31.69,46.8 31.69,41.97 31.05,41.34 18.99,41.34 17.84,40.2 17.84,35.24 17.27,34.67 10.1,34.67 7.68,37.08 7.68,50.99
MODE
  Top 0.254: IC1.1 22.33,80.22 22.35,80.2 22.35,79.82 27.94,79.82 28.38,80.26 28.38,82.23 27.88,82.74 JMP1.2
N$4
  Top 0.305: R12.2 40.45,68.52 40.45,68.45 41.08,67.82 44.78,67.82 Q2.B 44.91,66.77 44.9,66.75 | D3.A 44.9,66.75 | 44.9,66.75 44.78,66.75 R15.1
N$7
  Top 0.305: 31.24,74.55 C20.2 R14.2
N$9  (1 unrouted)
  Top 0.305: R11.2 46.54,69.85 46.8,69.6 | Q2.E 46.66,69.85 D3.C
N$11
  Top 0.254: C21.1 R10.1
N$12
  Top 0.305: Q2.C 42.72,73.47 43.86,74.61 Q3.3
N$18
  Bottom 3.81: B1.AC1 13.25,91.23 X1.2
N$20  (1 unrouted)
  Top 0.254: 17.78,82.49 R10.2 18.22,84.39 C19.1 | IC1.6 19.07,81.58 R10.2
N$22
  Top 0.61: D4.A 38.29,8 38.86,7.43 40.58,7.43 C24.1 41.28,6.73 43.5,6.73 43.56,6.67 L4.1
N$23
  Top 0.254: IC1.9 20.37,74.98 19.75,74.36 C6.1
N$24
  Top 0.203: 20.7,74.55 20.7,71.69
  Top 0.254: IC1.10 21.03,74.88 20.7,74.55 | R4.2 C8.2
  Top 0.305: 20.7,71.69 C8.2
N$25
  Top 0.305: ZD1.C 41.59,63.69 41.91,64.01 41.91,65.78 R15.2
N$26
  Top 0.254: C40.2 13.4,17.46 R23.2
N$27
  Top 0.254: IC5.6 17.64,17.41 16.83,18.22 15.81,18.22 14.86,17.27 14.86,14.54 14.41,14.1 11.49,14.1 | 11.56,15.56 C40.1 11.49,14.1 | 11.49,14.1 R20.2 | R20.2 11.5,12.63 | R25.1 13.4,10.86 11.5,12.76 R20.2
N$28
  Top 0.406: IC1.12 22.33,75.39 23.69,74.04 R7.2
N$29
  Top 0.356: C28.2 20.96,10.22 20.89,10.29 IC5.16
N$30
  Top 0.254: Q1.1 25.75,71.22 25.6,71.63
  Top 0.305: R6.1 25.59,70.93 25.78,71.12
  Top 0.406: R7.1 25.6,71.63 25.71,71.31 25.78,71.12
  pour Top (isolate 0.305, no thermals): 26.35,69.34 24.89,69.34 24.89,70.68 26.35,70.68
N$31
  Top 0.254: IC1.2 21.68,81.12 21.84,81.28 23.88,81.28 24,81.41
  Top 0.406: 24,81.41 24.26,81.41 R5.1
N$32
  Top 0.254: IC5.5 18.27,17.54 16.89,18.92 13.72,18.92 13.72,19.18 | 13.72,19.18 13.72,19.24 | R23.1 13.72,19.18
N$33
  Top 0.254: C9.2 22.42,84.26 | C9.2 22.42,84.14 | IC1.4 20.37,82.41 C9.2
N$34
  Bottom 0.406: 17.14,88.46 17.65,87.95
  Bottom 3.81: B1.AC2 20.75,91.04 17.65,87.95 7.69,77.99 X1.1
N$35
  Top 0.406: L3.1 28.09,34.52 29.4,33.21 R8.1
  pour Top (isolate 0.406, no thermals): 20.19,38.86 28.77,38.86 28.77,35.88 20.19,35.88
N$37
  Top 0.254: IC5.7 16.98,17.31 16.76,17.53 15.94,17.53 15.43,17.02 15.43,12.45 14.92,11.94 14.92,9.91 14.48,9.46 12.76,9.46 12,8.7 R22.1
N$38  (1 unrouted)
  Top 1.27: C13.2 27.37,56.52
N$39  (1 unrouted)
  Top 0.356: IC5.1 21.07,16.43 21.08,16.45
  Top 0.406: 21.08,16.45 22.67,16.45 C36.2
N$40
  Top 0.254: IC5.8 16.32,15.94 15.94,15.56 15.94,12.19 15.43,11.68 15.43,9.53 14.22,8.32
  Top 0.305: 14.22,8.32 13.65,8.32 C39.2
N$41
  Top 0.254: IC5.10 16.98,9.93 16.7,9.65 16.7,5.53 C33.1
N$42  (3 unrouted)
  Top 0.254: IC5.2 20.23,17.31 | R18.2 28.19,19.37 | 20.26,17.34 20.95,18.03 24.51,18.03 R17.1 | R17.1 R18.2
N$43
  Top 0.406: R21.1 LED1.C
N$46
  Top 0.406: C32.2 R19.2
N$47
  Top 0.254: R24.2 R26.1 48.45,30.36 47.37,31.43 IC6.7
N$127
  Top 0.254: X3.2 4.83,26.16 6.54,24.44 IC2.6
N$188  (1 unrouted)
  Top 0.305: R28.1 27.43,28.26 IC7.7 24.38,28.26 21.53,31.11 16.51,31.11 14.99,29.59 14.99,28.32
N$190
  Top 0.305: IC7.6 23.88,26.99 22.61,28.26 IC7.2 18.73,28.26 C44.2 18.29,26.8 17.72,26.23 13.78,26.23 12.45,27.56 X5.1
N$193
  Top 0.406: IC2.8 4,23.43 3.34,24.09 C22.1 2.16,28.19 X3.1
N$198
  Top 0.406: X3.3 7.82,27.87 IC2.5 7.82,21.09 7.43,20.7 3.3,20.7 2.16,21.84 C22.2
OUT+
  Top 0.305: X2.9 50.42,53.21 49.4,54.23 46.42,54.23 43.75,56.9 43.75,62.56 ZD1.A
P_OUT
  Top 0.406: L3.2 33.12,34.52 R8.2
  pour Top (isolate 0.406, no thermals): 42.23,60.64 42.86,60.64 43.18,60.33 43.5,60.01 43.5,53.34 40.64,50.48 40.64,39.05 37.47,35.88 32.38,35.88 32.38,40.01 35.56,43.18 35.56,50.8 39.37,54.61 39.37,60.01 40.01,60.64
PRE_OE  (via drill 0.6)  (1 unrouted)
  Top 0.254: v4.83,37.91 4.83,67.82 v8.45,71.44 | v14.16,74.87 15.24,74.87 15.3,74.93
  Top 0.305: X2.5 49.15,46.61 44.64,46.61 43.88,45.85 43.88,39.05 36.51,31.69 22.54,31.69 20.64,33.59 v10.41,33.59
  Bottom 0.254: v8.45,71.44 10.73,71.44 v14.16,74.87
  Bottom 0.305: v10.41,33.59 9.14,33.59 v4.83,37.91
PREG_OUT
  pour Top (isolate 0.305, no thermals): 49.85,64.45 52.07,64.45 52.7,63.82 52.7,60.01 52.07,59.37 49.85,59.37 48.9,58.42 48.9,57.78 48.26,57.15 44.45,57.15 44.45,60.96 45.09,61.59 48.9,61.59 49.21,61.91 49.21,63.82
PWRGOOD  (via drill 0.6)
  Top 0.305: v50.29,36.13 49.97,35.88 R27.2 49.21,34.61 48.58,33.97 IC6.5
  Bottom 0.305: X2.1 49.78,42.16 49.78,36.64 v50.29,36.13
SD
  Top 0.254: IC1.8 19.72,75.09 19.3,74.68 17.21,74.68 R2.2
SENSE  (via drill 0.6)
  Top 0.254: R3.2 v21.08,67.88 | R4.1 17.27,71.5 17.27,70.55 17.59,70.23 18.35,70.23 v19.18,69.41
  Bottom 0.254: v21.08,67.88 20.7,67.88 v19.18,69.41
  pour Top (isolate 0.305, no thermals): 26.61,66.04 22.86,66.04 22.54,66.36 22.54,69.34 23.88,69.34 24.77,68.45 26.61,68.45
SGND  (via drill 0.6)
  Top 0.406: C21.2 C19.2 R16.2 C9.1 | IC1.3 21.03,81.74 v21.54,82.25
  Bottom 0.813: v21.54,82.25 21.09,81.8 17.86,81.8 15.43,79.38 15.43,61.72 8.83,55.12 SH1.P$1
  pour Top (isolate 0.305, no thermals): 27.69,84.84 27.69,80.26 23.81,80.26 23.81,81.22 14.61,81.22 14.61,87.76 24.77,87.76
SW  (via drill 0.6)
  other vias: 31.37,60.52 33.4,58.48 31.37,58.48 35.37,64.58 33.4,62.55 32.38,59.5 33.4,60.52 35.37,62.55 34.42,63.56 31.37,64.58 34.42,59.5 31.37,62.55 33.4,64.58 30.35,59.5 30.35,63.56 32.38,61.53 32.38,63.56 35.37,60.52 30.35,61.53 34.42,61.53 35.37,58.48 30.35,65.6 32.38,65.6 34.42,65.6 35.43,66.61 31.37,66.61 33.4,66.61
  pour Top (isolate 0.305, no thermals): 38.42,70.48 36.7,72.2 28.89,72.2 28.89,59.5 29.84,58.74 30.99,57.59 30.99,55.12 30.8,54.93 25.91,54.93 25.46,54.48 25.46,50.93 34.35,50.93 38.42,54.99
  pour Bottom (isolate 0.406): 41.59,72.07 41.59,33.02 26.04,33.02 26.04,72.07
SW1
  Top 0.254: IC5.14 19.57,8.05
  Top 0.356: IC5.15 20.23,8.93 20.19,8.89
  pour Top (isolate 0.305, no thermals): 30.23,10.35 30.23,3.05 29.21,2.03 24.45,2.03 24.45,4.19 20.07,4.19 19.56,4.7 19.56,9.33 19.62,9.4 19.62,11.3 20.26,11.3 20.26,9.4 20.76,8.89 23.43,8.89 23.75,9.21 23.75,11.05 29.53,11.05
SYNC  (via drill 0.6)
  Top 0.254: IC5.4 18.94,17.7 16.95,19.68 16.32,19.68 v16.13,19.88 | X4.2 5.28,11.37 IC2.2 5.28,18.1 5.78,18.61 v9.14,18.61 9.14,30.73 3.87,36.01 3.87,69.91 v8.45,74.49
  Top 0.305: JMP1.3 v27.11,85.53
  Bottom 0.254: v27.11,85.53 19.43,85.53 8.38,74.49 v8.45,74.49 | v9.14,18.61 14.86,18.61 v16.13,19.88
SYNC_ISO
  cutout Bottom: 0.95,31.11 9.21,31.11 9.21,20.64 0.32,20.64 0.32,31.11
TEMP_FREQ  (via drill 0.6)
  Top 0.305: IC7.3 22.73,26.99 23.43,26.29 23.43,25.15 24.19,24.51 32,24.51 40.64,33.15 v43.81,33.15
  Bottom 0.305: X2.3 49.15,44.07 49.15,36.51 45.78,33.15 v43.81,33.15
V+  (via drill 0.6)
  Top 0.61: IC4.1 55.18,21.4 C29.1 | D6.C 55.62,21.14 55.88,21.4
  Top 0.813: 55.18,21.4 55.88,21.4 56.77,21.4 57.34,21.97 57.34,36.45 54.74,39.05 46.8,39.05 v46.04,39.81
  Bottom 0.813: v46.04,39.81 46.04,46.04 X2.6
V-
  Top 0.61: IC3.1 53.27,12.51 54.29,13.53 54.29,14.29 D5.A 54.29,14.67 C26.2
  Top 0.813: D5.A 56.77,14.48 58.67,16.38 58.67,37.27 55.5,40.45 47.69,40.45 46.04,42.1 46.04,43.5 X2.4
VBIAS  (1 unrouted)
  Top 0.406: C5.+ C5.+.1 | 56.83,79.44 57.14,79.44 D1.C
  Top 1.016: X2.18 47.88,64.39 49.47,65.98 53.59,65.98 53.59,67.44 | C5.+ 55.05,69.03 56.83,70.8 56.83,79.44 56.64,79.63 56.64,79.57
VOUT+  (via drill 0.6)
  Top 0.254: R20.1 v14.41,12.95 | v31.24,11.49 31.24,14.18 TR1.3 | IC5.11 17.64,9.28 v17.65,9.27
  Bottom 0.254: v31.24,11.49 30.48,10.73 17.65,10.73 | v14.41,12.95 16.64,10.73 17.65,10.73 | v17.65,9.27 17.65,10.73
  pour Top (isolate 0.305, no thermals): 30.99,11.94 30.42,12.51 30.42,18.29 29.97,18.73 29.34,18.73 29.34,19.94 33.15,19.94 33.34,20.13 33.34,21.65 34.29,22.61 42.35,22.61 43.05,21.91 43.05,16.95 42.16,16.07 38.86,16.07 34.73,11.94
VOUT-
  Top 1.016: D4.C 32.51,5.47 32.17,5.81 TR1.2
  pour Top (isolate 0.305, no thermals): 31.24,9.08 31.24,3.05 31.81,2.48 38.23,2.48 39.05,3.3 39.05,8.51 37.72,9.84 31.94,9.84 31.24,9.14

### Text on the board
Bottom: EEZ SMPS pre-regulator (03/2016 r1B1)
tPlace: AC in | EEZ SMPS pre-regulator (03/2016 r1B1) | Sync Out | Temp
tDocu: Licensed under the TAPR Open Hardware License (www.tapr.org/OHL)
_tNames: C1 | B1 | C19 | C9 | C21 | X1 | D1 | R5 | R1 | R10 | R16 | IC1 | C7 | JMP1 | C5 | R13 | R2 | C20 | Q3 | C6 | R14 | R7 | R4 | R12 | Q1 | R11 | R6 | Q2 | R3 | C8 | R15 | D3 | ZD1 | D2 | FB1 | C4 | C2 | C3 | C18 | C13 | C10 | R9 | C12 | C14 | L1 | C11 | C17 | L2 | X2 | C16 | C15 | L3 | R27 | IC6 | R8 | C42 | C44 | C43 | C41 | IC7 | X3 | R28 | C34 | R26 | R24 | IC4 | X5 | C22 | C38 | C37 | L5 | C30 | R17 | R18 | L6 | C35 | C29 | IC2 | C36 | D6 | R23 | IC5 | C31 | C27 | C26 | C23 | C40 | D5 | R20 | C28 | C25 | R25 | IC3 | X4 | R22 | C39 | C24 | L4 | C33 | D7 | C32 | LED1 | R21 | R19 | D4 | TR1